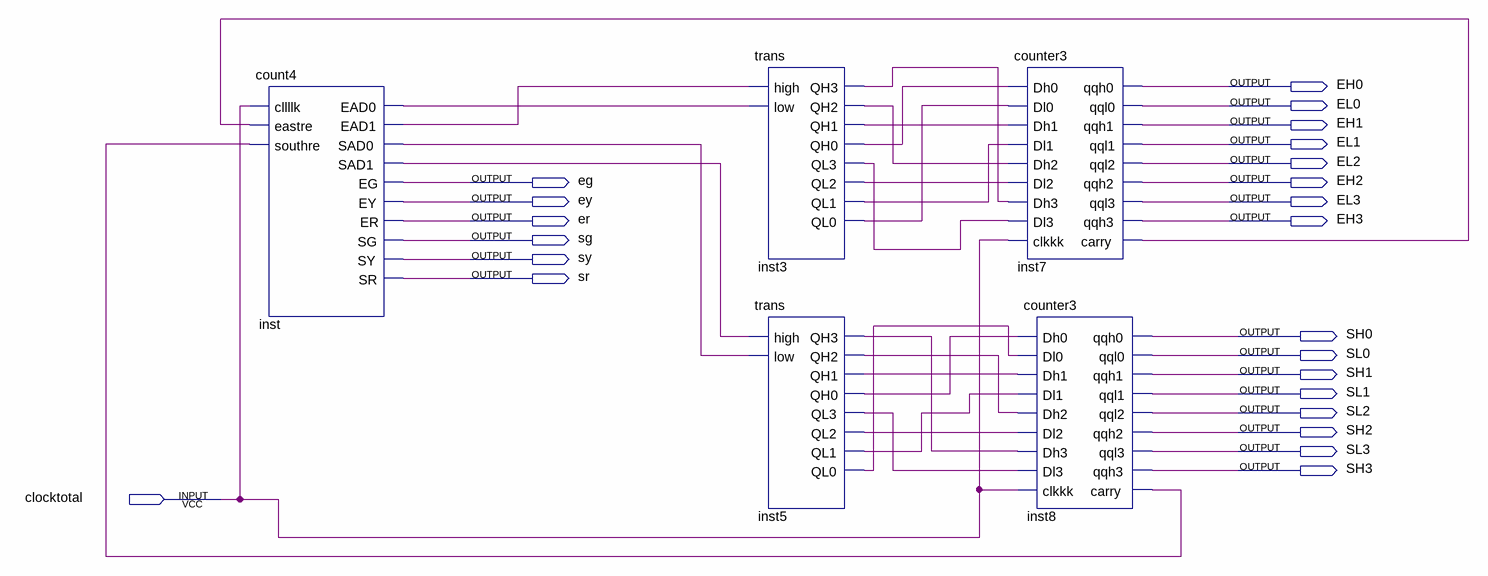
[diagram p0: schematic sheet]
// Quartus schematic led.bdf as structural Verilog: 5 symbols, 23 pins
module led (
  input  clocktotal,
  output EH0,
  output EL0,
  output EH1,
  output EL1,
  output EL2,
  output eg,
  output EH2,
  output ey,
  output EL3,
  output er,
  output EH3,
  output sg,
  output sy,
  output sr,
  output SH0,
  output SL0,
  output SH1,
  output SL1,
  output SL2,
  output SH2,
  output SL3,
  output SH3
);

  wire inst3_qh0, inst3_qh1, inst3_qh2, inst3_qh3, inst3_ql0, inst3_ql1, inst3_ql2, inst3_ql3, inst5_qh0,
       inst5_qh1, inst5_qh2, inst5_qh3, inst5_ql0, inst5_ql1, inst5_ql2, inst5_ql3, inst7_carry, inst8_carry,
       inst_ead0, inst_ead1, inst_sad0, inst_sad1;

  count4 inst (
    .cllllk(clocktotal), .eastre(inst7_carry), .southre(inst8_carry), .EAD0(inst_ead0), .EAD1(inst_ead1),
    .SAD0(inst_sad0), .SAD1(inst_sad1), .EG(eg), .EY(ey), .ER(er), .SG(sg), .SY(sy), .SR(sr));
  trans inst3 (
    .high(inst_ead1), .low(inst_ead0), .QH3(inst3_qh3), .QH2(inst3_qh2), .QH1(inst3_qh1), .QH0(inst3_qh0),
    .QL3(inst3_ql3), .QL2(inst3_ql2), .QL1(inst3_ql1), .QL0(inst3_ql0));
  trans inst5 (
    .high(inst_sad1), .low(inst_sad0), .QH3(inst5_qh3), .QH2(inst5_qh2), .QH1(inst5_qh1), .QH0(inst5_qh0),
    .QL3(inst5_ql3), .QL2(inst5_ql2), .QL1(inst5_ql1), .QL0(inst5_ql0));
  counter3 inst7 (
    .Dh0(inst3_qh0), .Dl0(inst3_ql0), .Dh1(inst3_qh1), .Dl1(inst3_ql1), .Dh2(inst3_qh2), .Dl2(inst3_ql2),
    .Dh3(inst3_qh3), .Dl3(inst3_ql3), .clkkk(clocktotal), .qqh0(EH0), .qql0(EL0), .qqh1(EH1), .qql1(EL1),
    .qql2(EL2), .qqh2(EH2), .qql3(EL3), .qqh3(EH3), .carry(inst7_carry));
  counter3 inst8 (
    .Dh0(inst5_qh0), .Dl0(inst5_ql0), .Dh1(inst5_qh1), .Dl1(inst5_ql1), .Dh2(inst5_qh2), .Dl2(inst5_ql2),
    .Dh3(inst5_qh3), .Dl3(inst5_ql3), .clkkk(clocktotal), .qqh0(SH0), .qql0(SL0), .qqh1(SH1), .qql1(SL1),
    .qql2(SL2), .qqh2(SH2), .qql3(SL3), .qqh3(SH3), .carry(inst8_carry));
endmodule
